# Altium schematic sheet blood-pressure-input-reference-custom-text.SchDoc
size 167 x 76 mm
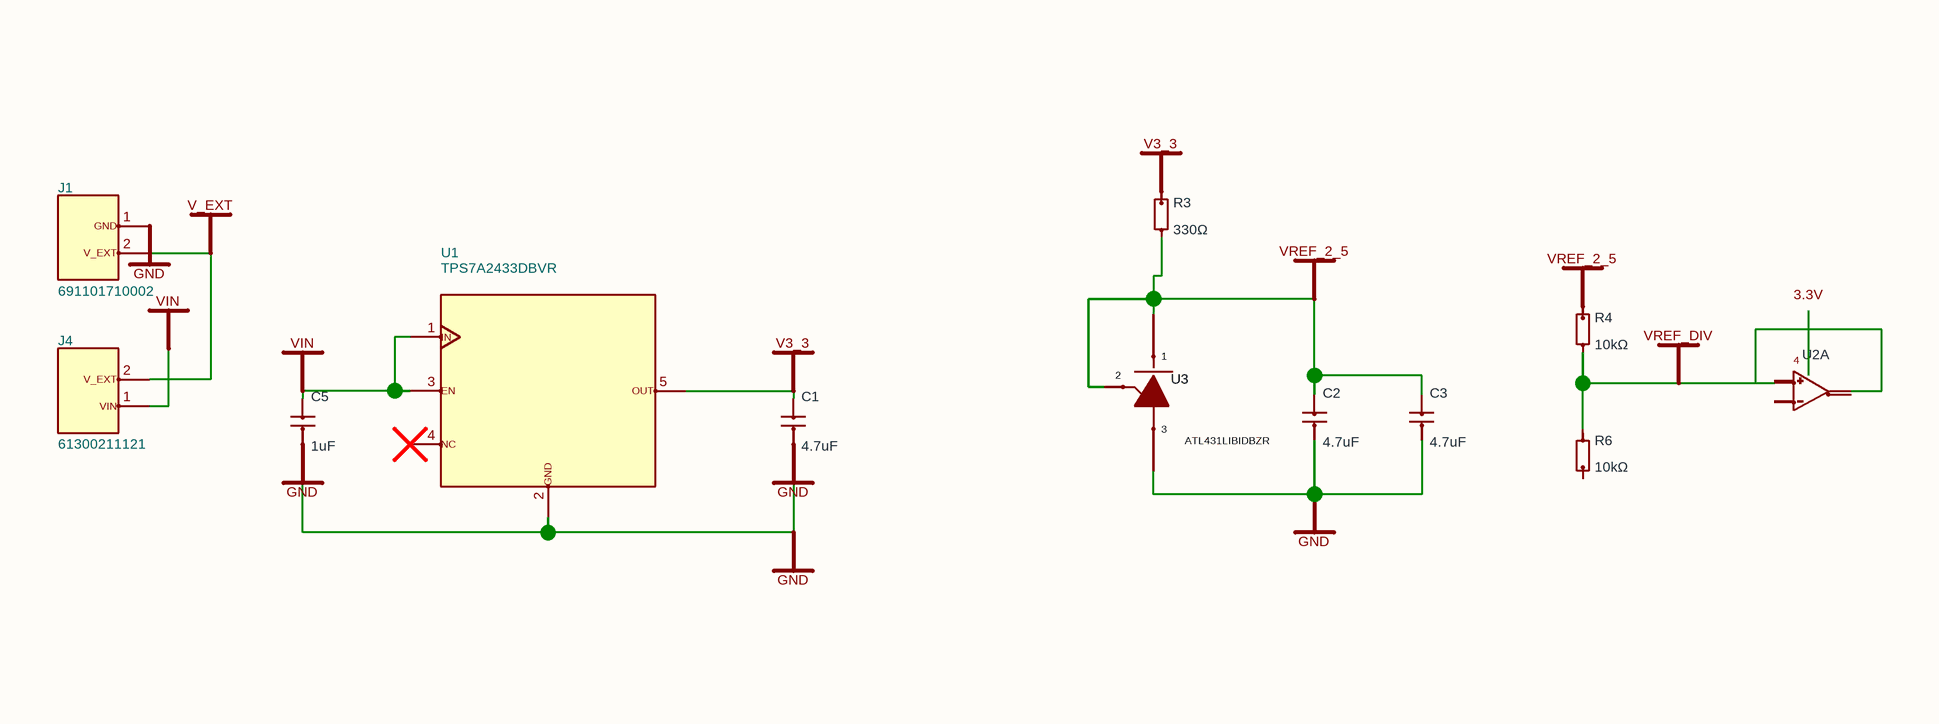
[diagram p0: blood-pressure-input-reference-custom-text.SchDoc]

## Parts
C1  4.7uF
C2  4.7uF
C3  4.7uF
C5  1uF
J1  (no value)
J4  (no value)
R3  330Ω
R4  10kΩ
R6  10kΩ
U1  (no value)
U2A  (no value)
U3  (no value)

## Nets
GND: C1.2(cathode) C2.2(cathode) C3.2(cathode) C5.2(cathode) J1.1(GND) U1.2(GND) U3.3(A)
V3_3: C1.1(anode) R3.1(anode) U1.5(OUT)
V_EXT: J1.2(V_EXT) J4.2(V_EXT)
VIN: C5.1(anode) J4.1(VIN) U1.1(IN) U1.3(EN)
VREF_2_5: C2.1(anode) C3.1(anode) R3.2(cathode) R4.1(anode) U3.1(K) U3.2(R)
VREF_DIV: R4.2(cathode) R6.1(anode) U2A.3(inp1)

Not connected (* = marked no-connect by the designer): R6 2(cathode); U1 4(NC)*; U2A 1(out) 2(inp2)

## Notes on the sheet
- (near U2A) 4
- (near U2A) 3.3V
- (in symbol J1) 691101710002
- (in symbol J4) 61300211121
- (in symbol U1) TPS7A2433DBVR
- (in symbol U3) ATL431LIBIDBZR

## Library data of the parts
C1-C3 C5 = capacitor_down
J1 = J1
J4 = J4
R3 R4 R6 = boxresistor_down
U1 = U1
U2A = opamp_no_power_right
U3 = U3